# EAGLE design humidity-v2.1 (EAGLE 5.11)
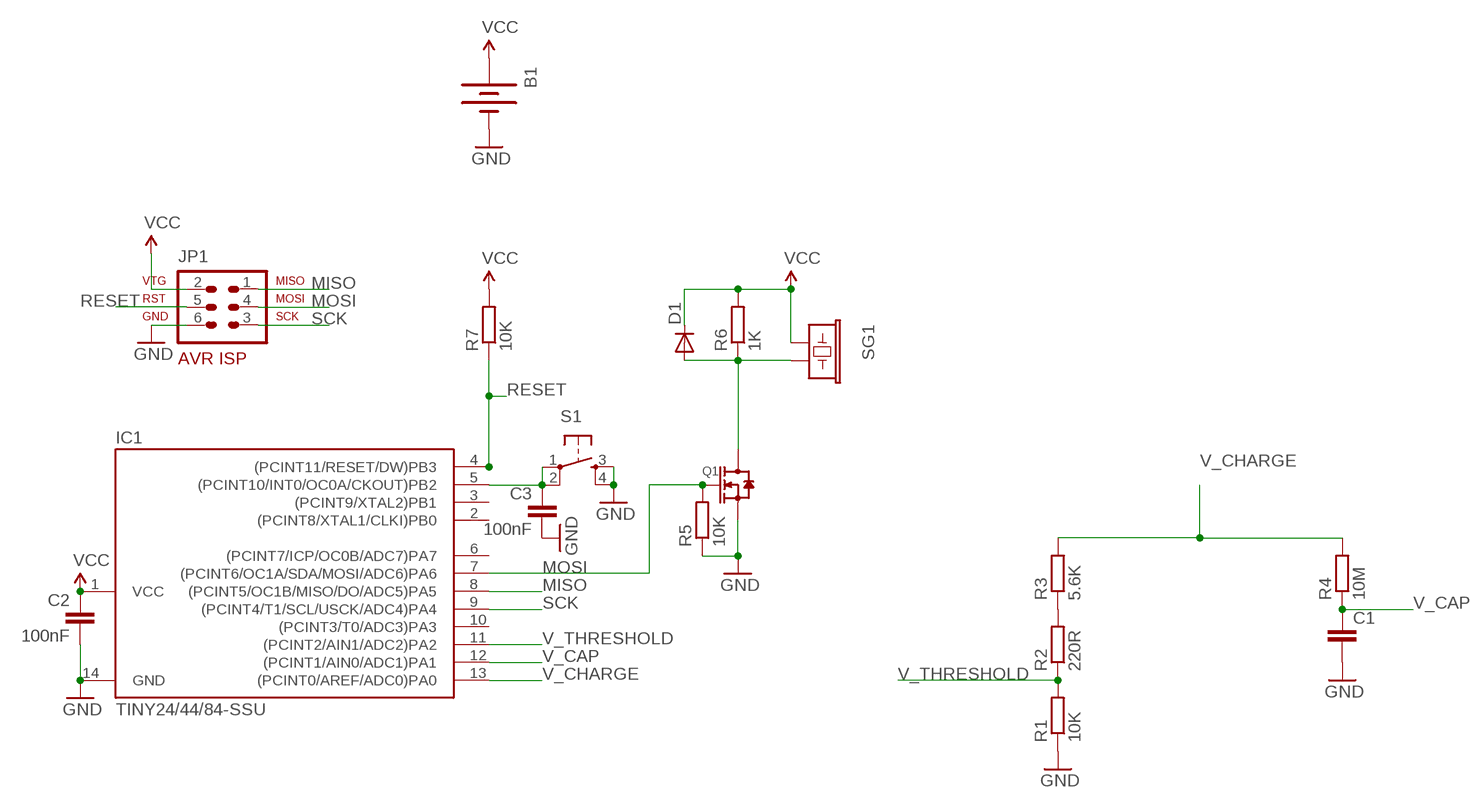
[diagram p0: schematic, sheet 1]

## Parts
B1  BATTERY  [BAT-HLD-001]
C1  CAPSMD  [GRM43D]
C2  100nF  C-EUC0603K  [C0603K]
C3  100nF  C-EUC0603K  [C0603K]
D1  DIODE-SCHOTTKY_  DIODESOD  [SOD-323]
IC1  TINY24/44/84-SSU  [SOIC14]
JP1  AVR-ISP-6  [AVR-ISP-6]
Q1  MOSFET-N-SOT23  [SOT23]
R1  10K  R-EU_R0603  [R0603]
R2  220R  R-EU_R0603  [R0603]
R3  5.6K  R-EU_R0603  [R0603]
R4  10M  R-EU_R0603  [R0603]
R5  10K  R-EU_R0603  [R0603]
R6  1K  R-EU_R0603  [R0603]
R7  10K  R-EU_R0603  [R0603]
S1  TAC_SWITCHPTH  [TACTILE-PTH]
SG1  BUZZERPTH  [BUZZER-12MM]

## Nets
GND: B1.2(-) C1.C C2.2 C3.2 IC1.14(GND) JP1.6 Q1.2(S) R1.1 R5.1 S1.3 S1.4
MISO: IC1.8((PCINT5/OC1B/MISO/DO/ADC5)PA5) JP1.1
MOSI: IC1.7((PCINT6/OC1A/SDA/MOSI/ADC6)PA6) JP1.4 Q1.1(G) R5.2
N$1: D1.2(A) Q1.3(D) R6.1 SG1.-
N$2: C3.1 IC1.5((PCINT10/INT0/OC0A/CKOUT)PB2) S1.1 S1.2
N$3: R2.2 R3.1
RESET: IC1.4((PCINT11/RESET/DW)PB3) JP1.5 R7.1
SCK: IC1.9((PCINT4/T1/SCL/USCK/ADC4)PA4) JP1.3
V_CAP: C1.A IC1.12((PCINT1/AIN0/ADC1)PA1) R4.1
V_CHARGE: IC1.13((PCINT0/AREF/ADC0)PA0) R3.2 R4.2
V_THRESHOLD: IC1.11((PCINT2/AIN1/ADC2)PA2) R1.2 R2.1
VCC: B1.1(+) C2.1 D1.1(C) IC1.1(VCC) JP1.2 R6.2 R7.2 SG1.+
Unconnected: IC1.2((PCINT8/XTAL1/CLKI)PB0) IC1.3((PCINT9/XTAL2)PB1) IC1.6((PCINT7/ICP/OC0B/ADC7)PA7) IC1.10((PCINT3/T0/ADC3)PA3)

## Library data of the parts
B1 = SparkFun:BATTERY: Battery Holders Various common sizes : AA, AAA, 20mm coin cell and 12mm coin cell.
C1 = SparkFun:CAP: Capacitor Standard 0603 ceramic capacitor, and 0.1" leaded capacitor.
C2 C3 = resistor:C-EU: CAPACITOR, European symbol
D1 = SparkFun:DIODE: Diode These are standard reverse protection diodes and small signal diodes. SMA package can handle up to about 1A. SOD-323 can handle about 200mA. What the SOD-323 package when ordering, there are some mfgs out there that are 5-pin packages.
IC1 = avr-5:TINY24/44/84
JP1 = avr-5:AVR-ISP-6: AVR ISP-6 Serial Programming Header
Q1 = Seeed-Discrete:MOSFET-N
R1-R7 = resistor:R-EU_: RESISTOR, European symbol
S1 = SparkFun:TAC_SWITCH: Momentary Switch Button commonly used for reset or general input. Spark Fun Electronics SKU : COM-00097
SG1 = SparkFun:BUZZER: Buzzer 12mm Spark Fun Electronics SKU : Comp-Buzzer

## Board
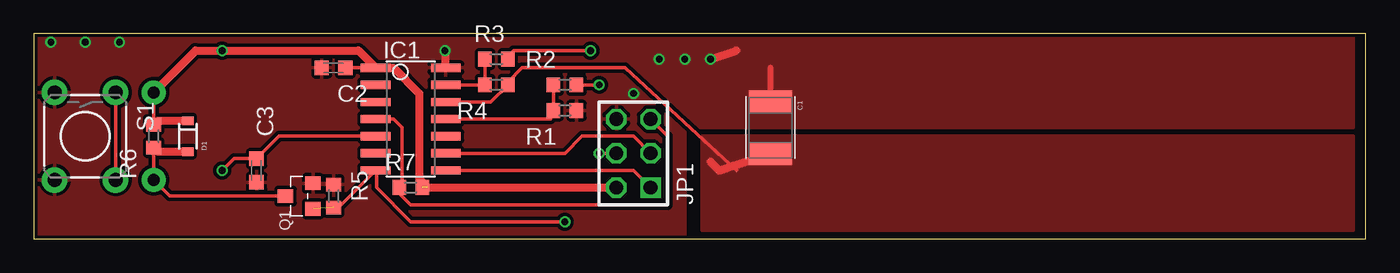
[diagram p1: board, top side]
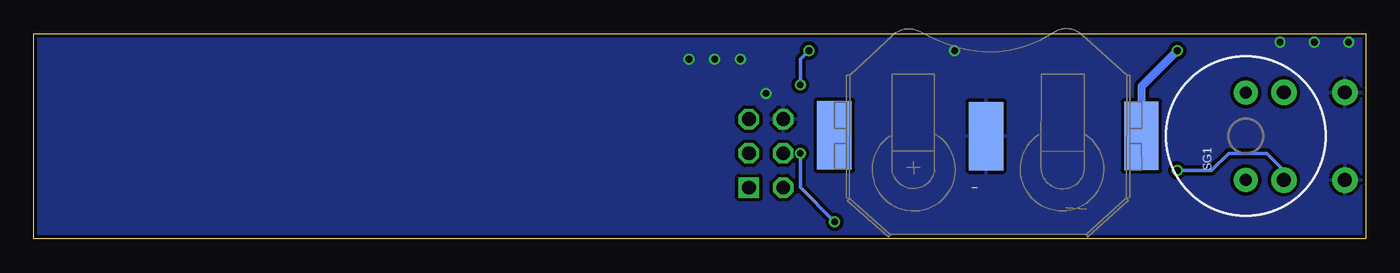
[diagram p2: board, bottom side, seen from below]

Size 98.73 x 15.23 mm. Coordinates in mm from the lower left corner, seen from the top.
Outline: 0,0 98.73,0 98.73,15.23 0,15.23 0,0
Copper layers (1*16): Top 0.035mm / dielectric 1.5mm / Bottom 0.035mm
Design rules "Fusion_eagle_rule_v1.1": minimum track width 6mil, minimum drill 12mil, track to track 6mil, track to pad 6mil, pad to pad 6mil, via to via 6mil, smd to smd 0mil, copper to edge 10mil, drill to drill 10mil, minimum pad ring 10mil, minimum via ring 6mil, stop-mask expansion 2mil, vias tented up to drill 100mil, thermal gap 10mil

### Footprints (pad centres in the part's own frame; a part is rotated, then mirrored left to right if it is on the bottom)
BAT-HLD-001 = smd 2.54 x 5.08: 1 -11.51,-0.02; 2 0,0; 3 11.25,-0.07
GRM43D = smd 1.65 x 3.2: A 1.927,0; C -1.927,0
C0603K = smd 1.05 x 1.08: 1 -0.875,0; 2 0.875,0
SOD-323 = smd 0.63 x 0.83: 1 -1.15,0; 2 1.15,0
SOIC14 = smd 0.61 x 2.21: 1 -3.81,-2.603; 2 -2.54,-2.603; 3 -1.27,-2.603; 4 0,-2.603; 5 1.27,-2.603; 6 2.54,-2.603; 7 3.81,-2.603; 8 3.81,2.603; 9 2.54,2.603; 10 1.27,2.603; 11 0,2.603; 12 -1.27,2.603; 13 -2.54,2.603; 14 -3.81,2.603
AVR-ISP-6 = drill 1.016 square: 1 -2.54,-1.27 | drill 1.016 octagon: 2 -2.54,1.27; 3 0,-1.27; 4 0,1.27; 5 2.54,-1.27; 6 2.54,1.27
SOT23 = smd 1.016 x 1.143: 1 -0.95,-1.016; 2 0.95,-1.016; 3 0,1.016
R0603 = smd 1 x 1.1: 1 -0.85,0; 2 0.85,0
TACTILE-PTH = drill 1.016 pad 1.88 round: 1 -3.251,2.261; 2 3.251,2.261; 3 -3.251,-2.261; 4 3.251,-2.261
BUZZER-12MM = drill 0.9 pad 1.778 round: + 3.25,0; - -3.25,0

### Placement (x,y rotation side)
B1  28.14,7.62 180 bottom
C1  54.61,8.26 270 top
C2  22.23,12.7 180 top
C3  16.51,5.08 270 top
D1  11.43,7.62 270 top
IC1  27.94,8.89 270 top
JP1  44.45,6.35 90 top
Q1  19.68,3.17 90 top
R1  39.37,9.53 180 top
R2  39.37,11.43 0 top
R3  34.29,13.34 180 top
R4  34.29,11.43 180 top
R5  22.23,3.17 270 top
R6  8.89,7.62 90 top
R7  27.94,3.81 0 top
S1  3.81,7.62 270 top
SG1  8.89,7.62 90 bottom

### Tracks (layer width: path | path; a pad name or v marks a point on that pad's centre or on a via)
GND  (via drill 0.5)
  Top 0.406: C1.C 54.61,12.7
  Top 0.61: IC1.14 30.54,13.91 v30.48,13.97 | v50.16,13.34 52.07,13.97
  other vias: 44.45,10.79 6.35,14.61 1.27,14.61 3.81,14.61 48.26,13.34 46.35,13.34
  pour Top (isolate 0.254): 0,15.24 0,0 48.26,0 48.26,15.24
  pour Top (isolate 0.254, no thermals): 47.62,8.26 97.79,8.26 97.79,15.24 47.62,15.24
  pour Bottom (isolate 0.254): 0,15.24 99.06,15.24 99.06,0 0,0
MISO
  Top 0.254: JP1.1 44.45,5.08 IC1.8
MOSI  (via drill 0.5)  (1 unrouted)
  Top 0.254: v41.91,6.35 JP1.4 | v39.37,1.27 27.94,1.27 25.4,3.81 25.4,5.02 IC1.7 22.58,2.33 R5.2
  Bottom 0.254: v41.91,6.35 41.91,3.81 v39.37,1.27
N$1
  Top 0.254: R6.1 SG1.- 10.09,3.17 Q1.3
  Top 0.61: R6.1 9.19,6.47 D1.2
N$2  (via drill 0.5)
  Top 0.254: IC1.5 18.18,7.62 C3.1 14.85,5.96 v13.97,5.08 | S1.2 S1.1
  Bottom 0.254: S1.2 6.07,5.08 7.34,6.35 10.16,6.35 11.43,5.08 v13.97,5.08
N$3  (via drill 0.5)
  Top 0.254: v41.91,11.43 R2.2 | R3.1 35.14,13.55 35.56,13.97 v41.27,13.97
  Bottom 0.254: v41.27,13.97 41.91,13.34 v41.91,11.43
RESET
  Top 0.254: JP1.5 46.99,7.62 46.99,2.54 27.94,2.54 27.09,3.39 R7.1 27.3,4.03 27.3,8.26 26.67,8.89 IC1.4
SCK
  Top 0.254: IC1.9 39.37,6.35 40.64,7.62 44.45,7.62 JP1.3
V_CAP
  Top 0.254: 51.95,5.44 52.07,5.32 52.07,5.08 43.81,12.7 36.2,12.7 35.14,11.64 R4.1 33.87,10.16 IC1.12
  Top 0.61: C1.A 51.95,5.44 50.82,5.06 50.16,5.71
  pour Top (isolate 0.254, no thermals): 49.53,7.62 97.79,7.62 97.79,0.64 49.53,0.64
V_CHARGE
  Top 0.254: R3.2 R4.2 IC1.13
V_THRESHOLD
  Top 0.254: R2.1 R1.2 38.32,8.89 IC1.11
VCC  (via drill 0.5)  (1 unrouted)
  Top 0.254: R6.2 SG1.+ | IC1.1 C2.1
  Top 0.406: R6.2 9.19,8.77
  Top 0.61: 9.19,8.77 D1.1 | JP1.2 29.21,3.81 28.57,4.45 28.57,10.79 26.67,12.7 IC1.1 24.07,13.97 v13.97,13.97 11.99,13.97 SG1.+
  Bottom 0.61: B1.1 16.63,11.31 v13.97,13.97